# EAGLE schematic Envelope (EAGLE 9.6.2)
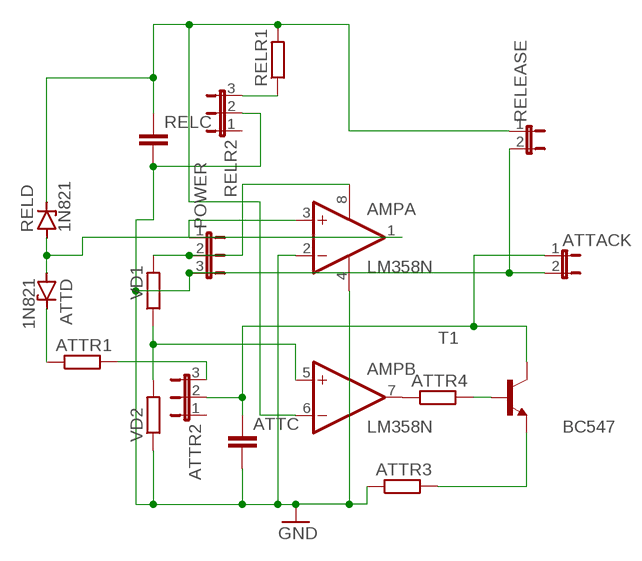
[diagram p0: schematic, sheet 1]

## Parts
AMP  LM358N  [DIL08]
ATTACK  JP1E  [JP1]
ATTC  C-EU025-025X050  [C025-025X050]
ATTD  1N821  [DO35Z10]
ATTR1  R-EU_0207/10  [0207/10]
ATTR2  JP2E  [JP2]
ATTR3  R-EU_0207/10  [0207/10]
ATTR4  R-EU_0207/10  [0207/10]
POWER  JP2E  [JP2]
RELC  C-EU025-025X050  [C025-025X050]
RELD  1N821  [DO35Z10]
RELEASE  JP1E  [JP1]
RELR1  R-EU_0207/10  [0207/10]
RELR2  JP2E  [JP2]
T1  BC547  [TO92]
VD1  R-EU_0207/10  [0207/10]
VD2  R-EU_0207/10  [0207/10]

## Nets
GND: AMP.2(A:-IN) AMP.4(P:V-) ATTACK.2 ATTC.2 ATTR3.1 POWER.3 RELC.2 RELEASE.2 RELR2.2 VD2.1
N$1: AMP.5(B:+IN) VD1.1 VD2.2
N$2: AMP.7(B:OUT) ATTR4.1
N$3: ATTR4.2 T1.2(B)
N$4: ATTR1.2 ATTR2.3
N$5: ATTR3.2 T1.1(E)
N$6: ATTACK.1 ATTC.1 ATTR2.2 T1.3(C)
N$7: ATTD.C ATTR1.1
N$8: AMP.1(A:OUT) ATTD.A RELD.A
N$9: AMP.8(P:V+) POWER.2 VD1.2
N$10: AMP.3(A:+IN) POWER.1
N$11: AMP.6(B:-IN) RELC.1 RELD.C RELEASE.1 RELR1.2
N$12: RELR1.1 RELR2.3
Unconnected: ATTR2.1 RELR2.1

## Library data of the parts
AMP = linear:LM358: OP AMP also LM158; LM258; LM2904 Source: http://cache.national.com/ds/LM/LM158.pdf
ATTACK RELEASE = jumper:JP1E: JUMPER
ATTC RELC = rcl:C-EU: CAPACITOR, European symbol; SPICEPREFIX: C
ATTD RELD = diode:1N821: Reference DIODE temperature compensated, 6,2 V
ATTR1 ATTR3 ATTR4 RELR1 VD1 VD2 = rcl:R-EU_: RESISTOR, European symbol; SPICEPREFIX: R
ATTR2 POWER RELR2 = jumper:JP2E: JUMPER
T1 = transistor:BC547: NPN TRANSISTOR